# Altium project LED Dice v2.PrjPcb
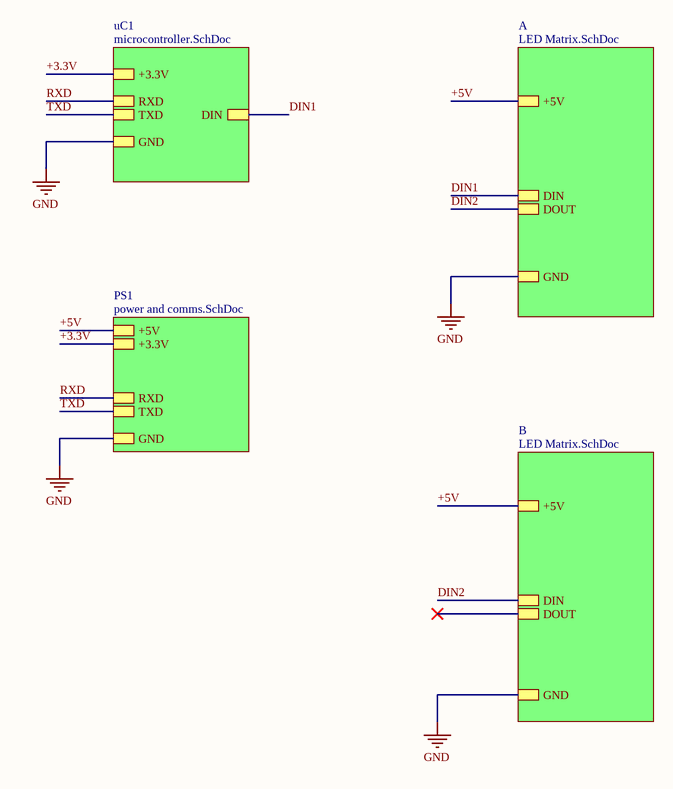
[diagram p0: LED Dice.SchDoc]
4 sheets, 52 parts. Net scope: hierarchical (ports join the sheet entries above them; power ports are global).
Board file: LED Dice.PcbDoc
Sheets:
  LED Dice.SchDoc
    uC1 = microcontroller.SchDoc
    PS1 = power and comms.SchDoc
    A = LED Matrix.SchDoc
    B = LED Matrix.SchDoc

## Sheet LED Dice.SchDoc
size A4; Date: 21 Jul 2025; CompanyName: Abdullah; Engineer: Abdullah; Revision: 2; SheetNumber: 1; SheetTotal: 4

### Sub-sheets
A = LED Matrix.SchDoc: GND, +5V, DIN, DOUT
B = LED Matrix.SchDoc: GND, +5V, DIN, DOUT
PS1 = power and comms.SchDoc: +5V, GND, +3.3V, RXD, TXD
uC1 = microcontroller.SchDoc: GND, +3.3V, RXD, TXD, DIN

### Nets
GND: sheet uC1/GND, sheet PS1/GND, sheet A/GND, sheet B/GND
+3.3V: sheet uC1/+3.3V, sheet PS1/+3.3V
+5V: sheet PS1/+5V, sheet A/+5V, sheet B/+5V
DIN1: sheet uC1/DIN, sheet A/DIN  [project net DIN]
DIN2: sheet A/DOUT, sheet B/DIN  [project net DIN]
RXD: sheet uC1/RXD, sheet PS1/RXD
TXD: sheet uC1/TXD, sheet PS1/TXD

### Notes on the sheet
- Project Title
- Engineer
- Company
- Revision
- Date
- Doc Name:
- Sheet
- of

## Sheet microcontroller.SchDoc
size A4; Date: 21 Jul 2025; CompanyName: Abdullah; Engineer: Abdullah; Revision: 2; SheetNumber: 3; SheetTotal: 4
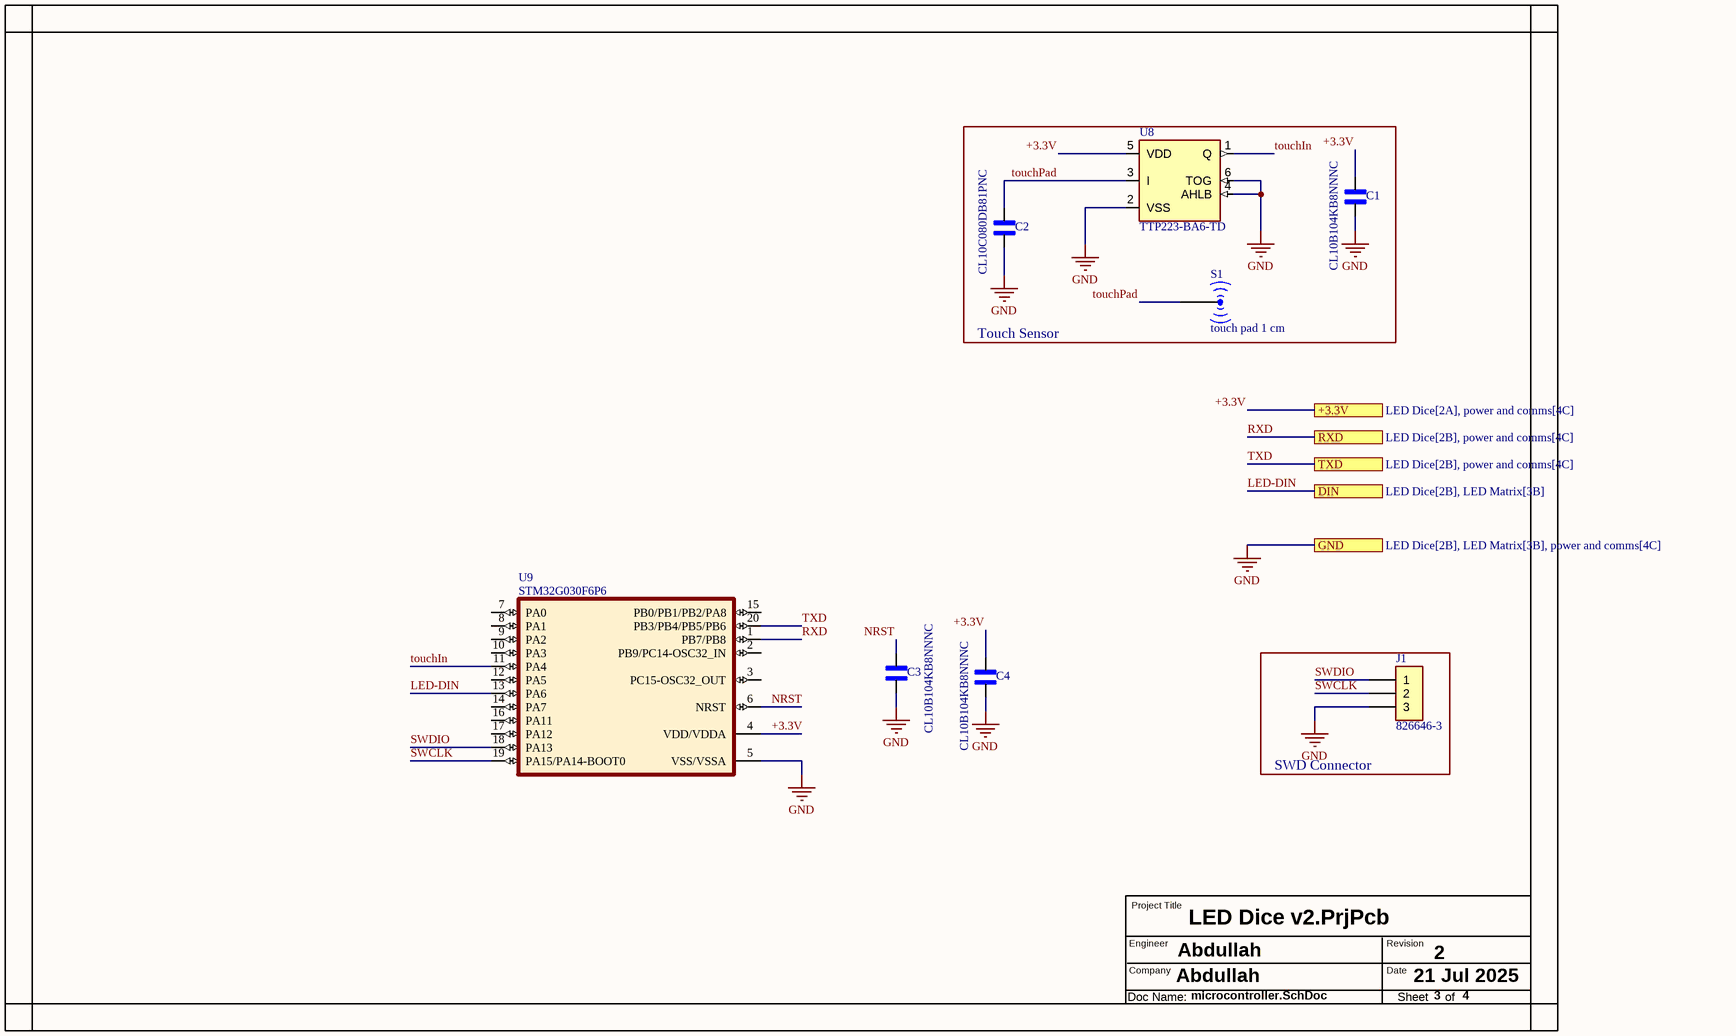
[diagram p1: microcontroller.SchDoc]

### Parts
C1  CL10B104KB8NNNC  [CAPC1608X90N]
C2  CL10C080DB81PNC  [CAPC1608X90N]
C3  CL10B104KB8NNNC  [CAPC1608X90N]
C4  CL10B104KB8NNNC  [CAPC1608X90N]
J1  826646-3  [TE_826646-3]
S1  touch pad 1 cm  [touch pad 1 cm]
U8  TTP223-BA6-TD  [SOT23-6]
U9  STM32G030F6P6  [*TSSOP20]

### Blocks framed on the sheet
Touch Sensor: C1 C2 S1 U8
SWD Connector: J1

### Ports
+3.3V (see LED Dice[2A], power and comms[4C]), DIN (see LED Dice[2B], LED Matrix[3B]), GND (see LED Dice[2B], LED Matrix[3B], power and comms[4C]), RXD (see LED Dice[2B], power and comms[4C]), TXD (see LED Dice[2B], power and comms[4C])

### Nets
GND: C1.1 C2.1 C3.1 C4.1 J1.3 U8.2(VSS) U8.4(AHLB) U8.6(TOG) U9.5(VSS/VSSA) ; port GND
+3.3V: C1.2 C4.2 U8.5(VDD) U9.4(VDD/VDDA) ; port +3.3V
LED-DIN: U9.13(PA6) ; port DIN  [project net DIN]
NRST: C3.2 U9.6(NRST)
RXD: U9.1(PB7/PB8) ; port RXD
SWCLK: J1.2 U9.19(PA15/PA14-BOOT0)
SWDIO: J1.1 U9.18(PA13)
touchIn: U8.1(Q) U9.11(PA4)
touchPad: C2.2 S1.1(in) U8.3(I)
TXD: U9.20(PB3/PB4/PB5/PB6) ; port TXD

Not connected (* = marked no-connect by the designer): U9 2(PB9/PC14-OSC32_IN) 3(PC15-OSC32_OUT) 7(PA0) 8(PA1) 9(PA2) 10(PA3) 12(PA5) 14(PA7) 15(PB0/PB1/PB2/PA8) 16(PA11) 17(PA12)

### Notes on the sheet
- Project Title
- Engineer
- Company
- Revision
- Date
- Doc Name:
- Sheet
- of

### Library data of the parts
C1 C3 C4 = CL10B104KB8NNNC: 0.1ÂµF Â±10% 50V Ceramic Capacitor X7R 0603 _1608 Metric_; MF: Samsung Electro-Mechanics; Price: None; MP: CL10B104KB8NNNC; SnapEDA_Link: https://www.snapeda.com/parts/CL10B104KB8NNNC/Samsung%20Electro-Mechanics/view-part/3598309/?ref=snap; Availability: Unavailable; Package: 0603 Samsung; Value: *
C2 = CL10C080DB81PNC: 50V 8pF C0G 0603 Multilayer Ceramic Capacitors MLCC - SMD/SMT ROHS; MP: GRM0335C1E8R0CA01D; Package: None; Price: None; Value: *; Availability: Unavailable
J1 = 826646-3: Connector Header Through Hole 3 position 0.100 (2.54mm); MF: TE Connectivity; SnapEDA_Link: https://www.snapeda.com/parts/826646-3/TE%20Connectivity%20AMP%20Connectors/view-part/2389612/?ref=snap; Mouser-Purchase-URL: https://snapeda.com/shop?store=Mouser&id=2389612; Availability: Good; DigiKey-Purchase-URL: https://snapeda.com/shop?store=DigiKey&id=2389612; MP: 826646-3; Package: None; Value: *; Price: None; EU_RoHS_Compliance: Compliant; Arrow_Europe-Purchase-URL: https://snapeda.com/shop?store=Arrow+Europe&id=2389612
S1 = touch pad 1 cm: Touch pad circular 1 cm
U8 = TTP223-BA6-TD: 1 key touchpad detector IC; MF: tontek; Value: *; SnapEDA_Link: https://www.snapeda.com/parts/TTP223-BA6/TONTEK/view-part/?ref=snap; Price: None; Availability: Not in stock; Package: None; MP: TTP223-BA6; Check_prices: https://www.snapeda.com/parts/TTP223-BA6/TONTEK/view-part/?ref=eda
U9 = STM32G030F6P6: ARMÂ® CortexÂ®-M0+ STM32G0 Microcontroller IC 32-Bit Single-Core 64MHz 32KB (32K x 8) FLASH 20-TSSOP; MF: STMicroelectronics; SnapEDA_Link: https://www.snapeda.com/parts/STM32G030F6P6/STMicroelectronics/view-part/?ref=snap; Package: TSSOP-20 STMicroelectronics; MP: STM32G030F6P6; Check_prices: https://www.snapeda.com/parts/STM32G030F6P6/STMicroelectronics/view-part/?ref=eda; Value: *

## Sheet power and comms.SchDoc
size A4; Date: 21 Jul 2025; CompanyName: Abdullah; Engineer: Abdullah; Revision: 2; SheetNumber: 4; SheetTotal: 4
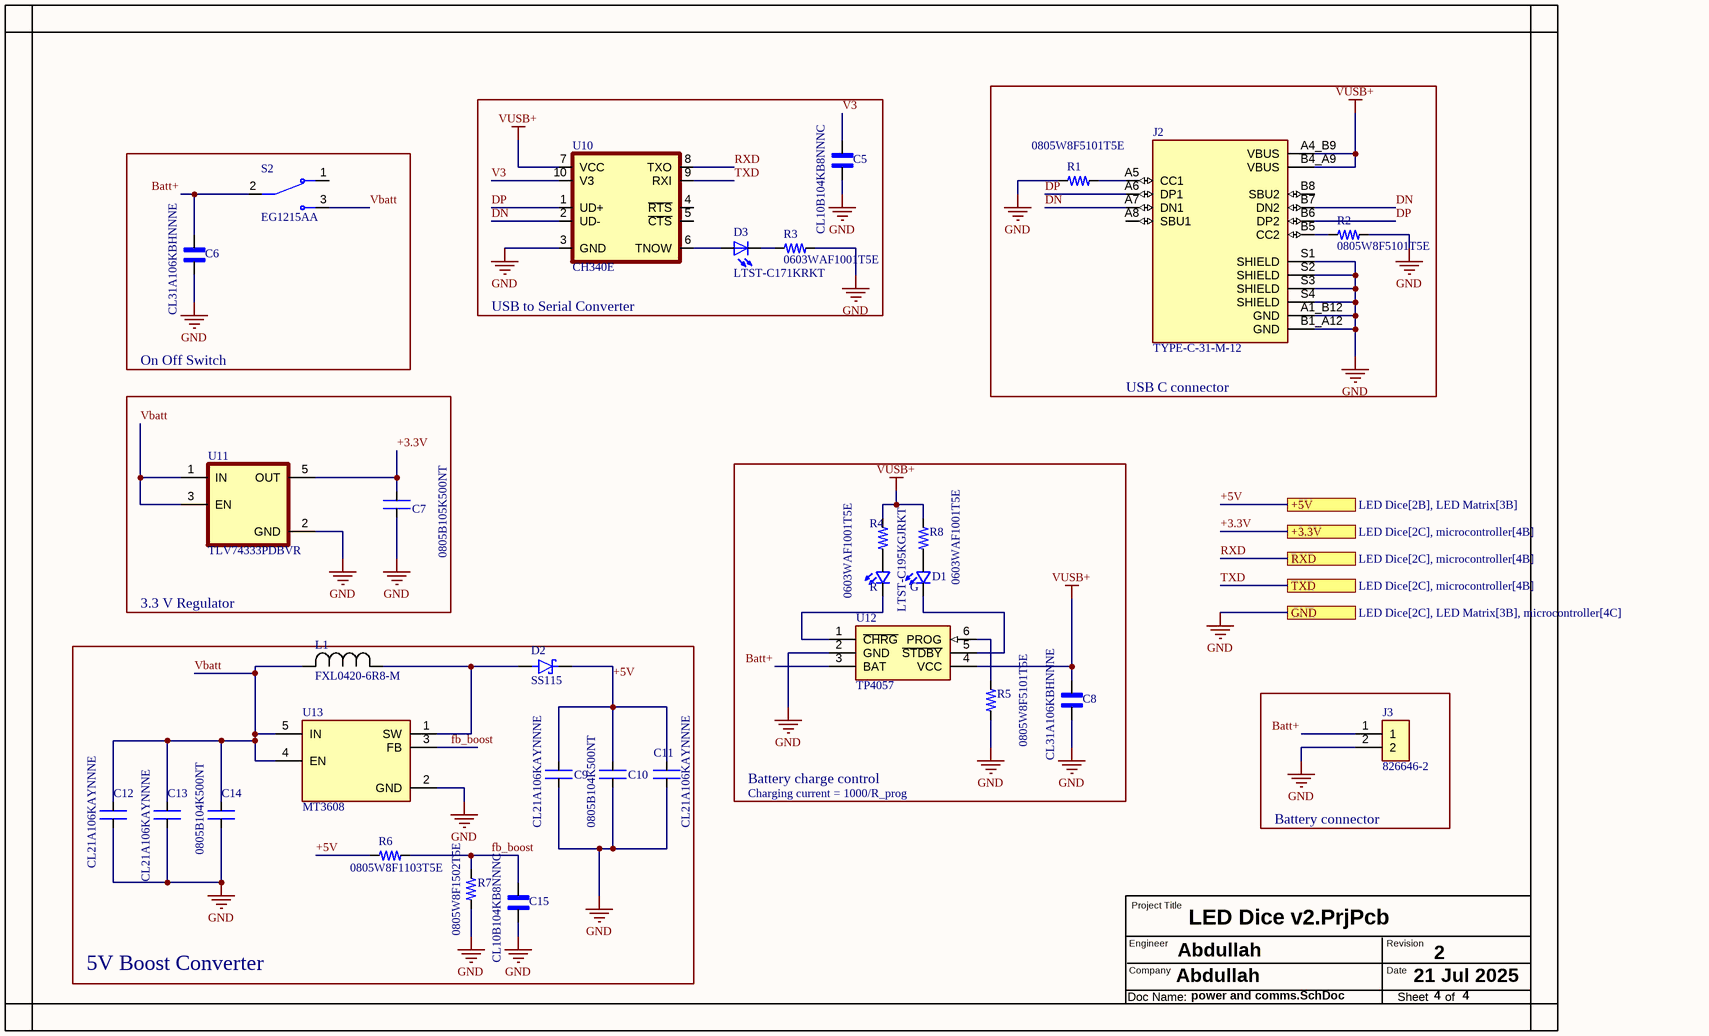
[diagram p2: power and comms.SchDoc]

### Parts
C5  CL10B104KB8NNNC  [CAPC1608X90N]
C6  CL31A106KBHNNNE  [WCAP-CSGP_885012208060]
C7  0805B105K500NT  [CAPC2012X135N]
C8  CL31A106KBHNNNE  [WCAP-CSGP_885012208060]
C9  CL21A106KAYNNNE  [CAPC2012X135N]
C10  CL21A106KAYNNNE  [CAPC2012X135N]
C11  0805B104K500NT  [CAPC2012X135N]
C12  CL21A106KAYNNNE  [CAPC2012X135N]
C13  CL21A106KAYNNNE  [CAPC2012X135N]
C14  0805B104K500NT  [CAPC2012X135N]
C15  CL10B104KB8NNNC  [CAPC1608X90N]
D1  LTST-C195KGJRKT  [LTST-BILED-15X16]
D2  SS115  [DIOM4325X250N]
D3  LTST-C171KRKT  [DIOC200X125X110]
J2  TYPE-C-31-M-12  [HRO_TYPE-C-31-M-12]
J3  826646-2  [TE_826646-2]
L1  FXL0420-6R8-M  [IND_FXL0420_CMT]
R1  0805W8F5101T5E  [RESC2012X65N]
R2  0805W8F5101T5E  [RESC2012X65N]
R3  0603WAF1001T5E  [RESC1508X60N]
R4  0603WAF1001T5E  [RESC1508X60N]
R5  0805W8F5101T5E  [RESC2012X65N]
R6  0805W8F1103T5E  [RESC2012X65N]
R7  0805W8F1502T5E  [RESC2012X65N]
R8  0603WAF1001T5E  [RESC1508X60N]
S2  EG1215AA  [SW_EG1215AA]
U10  CH340E  [MSOP10]
U11  TLV74333PDBVR  [SOT95P280X145-5N]
U12  TP4057  [SOT23-6]
U13  MT3608  [SOT95P280X145-6N]

### Blocks framed on the sheet
USB C connector: J2 R1 R2
USB to Serial Converter: C5 D3 R3 U10
On Off Switch: C6 S2
3.3 V Regulator: C7 U11
Battery charge control: C8 D1 R4 R5 R8 U12
5V Boost Converter: C9-C15 D2 L1 R6 R7 U13
Battery connector: J3

### Ports
+3.3V (see LED Dice[2C], microcontroller[4B]), +5V (see LED Dice[2B], LED Matrix[3B]), GND (see LED Dice[2C], LED Matrix[3B], microcontroller[4C]), RXD (see LED Dice[2C], microcontroller[4B]), TXD (see LED Dice[2C], microcontroller[4B])

### Nets
GND: C5.1 C6.1 C7.2(C) C8.1 C9.1(A) C10.1(A) C11.2(C) C12.1(A) C13.1(A) C14.2(C) C15.1 J2.A1_B12(GND) J2.B1_A12(GND) J2.S1(SHIELD) J2.S2(SHIELD) J2.S3(SHIELD) J2.S4(SHIELD) J3.2 R1.2 R2.1 R3.2 R5.1 R7.1 U10.3(GND) U11.2(GND) U12.2(GND) U13.2(GND) ; port GND
VUSB+: C8.2 J2.A4_B9(VBUS) J2.B4_A9(VBUS) R4.2 R8.2 U10.7(VCC) U12.4(VCC)
+3.3V: C7.1(A) U11.5(OUT) ; port +3.3V
+5V: C9.2(C) C10.2(C) C11.1(A) D2.C(K) R6.2 ; port +5V
Batt+: C6.2 J3.1 S2.2 U12.3(BAT)
DN: J2.A7(DN1) J2.B7(DN2) U10.2(UD-)
DP: J2.A6(DP1) J2.B6(DP2) U10.1(UD+)
fb_boost: C15.2 R6.1 R7.2 U13.3(FB)
RXD: U10.8(TXO) ; port RXD
TXD: U10.9(RXI) ; port TXD
V3: C5.2 U10.10(V3)
Vbatt: C12.2(C) C13.2(C) C14.1(A) L1.2 S2.3 U11.1(IN) U11.3(EN) U13.4(EN) U13.5(IN)
NetD1_P$1: D1.P$1(A1) R8.1
NetD1_P$2: D1.P$2(A2) R4.1
NetD1_P$3: D1.P$3(K1) U12.5(~{STDBY})
NetD1_P$4: D1.P$4(K2) U12.1(~{CHRG})
NetD2_A: D2.A L1.1 U13.1(SW)
NetD3_NEG: D3.NEG R3.1
NetD3_POS: D3.POS U10.6(TNOW)
NetJ2_A5: J2.A5(CC1) R1.1
NetJ2_B5: J2.B5(CC2) R2.2
NetR5_2: R5.2 U12.6(PROG)

Not connected (* = marked no-connect by the designer): J2 A8(SBU1) B8(SBU2); S2 1; U10 4(~{RTS}) 5(~{CTS})

### Notes on the sheet
- Charging current = 1000/R_prog
- Project Title
- Engineer
- Company
- Revision
- Date
- Doc Name:
- Sheet
- of
- (in symbol LTST-C195KGJRKT) R; G

### Library data of the parts
C5 C15 = CL10B104KB8NNNC: as C1 on sheet microcontroller; Price: None; MP: CL10B104KB8NNNC; SnapEDA_Link: https://www.snapeda.com/parts/CL10B104KB8NNNC/Samsung%20Electro-Mechanics/view-part/3598309/?ref=snap; Availability: Unavailable; Package: 0603 Samsung; Value: *
C6 C8 = CL31A106KBHNNNE: 50V 10uF X5R ±10% 1206 Multilayer Ceramic Capacitors MLCC - SMD/SMT ROHS; MP: 885012208060; Package: None; Price: None; Value: *; Availability: Unavailable
C7 = 0805B105K500NT: 50V 1uF X7R ±10% 0805 Multilayer Ceramic Capacitors MLCC - SMD/SMT ROHS
C9 C10 C12 C13 = CL21A106KAYNNNE: 25V 10uF X5R ±10% 0805 Multilayer Ceramic Capacitors MLCC - SMD/SMT ROHS; MP: CL31A106KPHNNNE; Package: None; Price: None; Value: *; Availability: Unavailable
C11 C14 = 0805B104K500NT: 50V 100nF X7R ±10% 0805 Multilayer Ceramic Capacitors MLCC - SMD/SMT ROHS; Supplier 1: Digikey; Supplier Part Number 1: 1763-1217-1-ND
D1 = LTST-C195KGJRKT: Green, Red 571nm Green, 631nm Red LED Indication - Discrete 2V Green, 2V Red 0606 (1616 Metric); MF: Lite-On Inc.; Package: None; Price: None; Check_prices: https://www.snapeda.com/parts/LTST-C195KGJRKT/Lite-On+Inc./view-part/?ref=eda; Value: *; SnapEDA_Link: https://www.snapeda.com/parts/LTST-C195KGJRKT/Lite-On+Inc./view-part/?ref=snap; MP: LTST-C195KGJRKT; Availability: In Stock; Purchase-URL: https://pricing.snapeda.com/search?q=LTST-C195KGJRKT&ref=eda
D2 = SS115: 1A, 150V, Schottky Rectifier; MF: Taiwan Semiconductor; Package: DO-214AC-2 Taiwan Semiconductor; Check_prices: https://www.snapeda.com/parts/SS115/Taiwan+Semiconductor/view-part/?ref=eda; Value: *; Price: None; Purchase-URL: https://pricing.snapeda.com/search/part/SS115/?ref=eda; MP: SS115; SnapEDA_Link: https://www.snapeda.com/parts/SS115/Taiwan+Semiconductor/view-part/?ref=snap; Availability: In Stock; Supplier 1: Digikey; Supplier Part Number 1: 1801-SS115TR-ND
D3 = LTST-C171KRKT: Red LED  0805 _2012 Indication 631nm - Discrete 2V 0805 _2012 Metric_; MF: Lite-On Inc.; MP: LTST-C171KRKT; Package: 0805 Lite-On; Price: None; Availability: Unavailable; SnapEDA_Link: https://www.snapeda.com/parts/LTST-C171KRKT/Lite-On%20Inc./view-part/357775/?ref=snap; Value: *
J2 = TYPE-C-31-M-12: USB Connectors 24 Receptacle 1 8.94*7.3mm RoHS; MF: HRO Electronics Co., Ltd.; Price: None; Value: *; SnapEDA_Link: https://www.snapeda.com/parts/TYPE-C-31-M-12/HRO+Electronics+Co.%252C+Ltd./view-part/?ref=snap; Package: Package; Availability: Not in stock; Check_prices: https://www.snapeda.com/parts/TYPE-C-31-M-12/HRO+Electronics+Co.%252C+Ltd./view-part/?ref=eda; MP: TYPE-C-31-M-12
J3 = 826646-2: Conn Unshrouded Header HDR 2 POS 2.54mm Solder ST Thru-Hole; Centerline_Pitch: 2.54 mm[.1 in]; Product_Type: Connector; MF: TE Connectivity; Number_of_Positions: 2; Availability: Good; Price: None; EU_RoHS_Compliance: Compliant; Value: *; DigiKey-Purchase-URL: https://snapeda.com/shop?store=DigiKey&id=470405; Mouser-Purchase-URL: https://snapeda.com/shop?store=Mouser&id=470405; SnapEDA_Link: https://www.snapeda.com/parts/826646-2/TE%20Connectivity%20AMP%20Connectors/view-part/470405/?ref=snap; Package: None; MP: 826646-2
L1 = FXL0420-6R8-M: Description; Manufacturer_Name: Cjiang; Copyright: Copyright (C) 2025 Ultra Librarian. All rights reserved.; Manufacturer_Part_Number: FXL0420-6R8-M
R1 R2 R5 = 0805W8F5101T5E: 5.1kΩ 0805  125mW Thick Film Resistors 150V ±100ppm/℃ ±1% Chip Resistor - Surface Mount ROHS
R3 R4 R8 = 0603WAF1001T5E: 1kΩ 0603 100mW Thick Film Resistors 75V ±100ppm/℃ ±1%  Chip Resistor - Surface Mount ROHS
R6 = 0805W8F1103T5E: 110kΩ 0805  125mW Thick Film Resistors 150V ±100ppm/℃ ±1% Chip Resistor - Surface Mount ROHS; Supplier 1: Mouser; Supplier Part Number 1: 303-0805W8F1001T5E
R7 = 0805W8F1502T5E: 15kΩ 0805  125mW Thick Film Resistors 150V ±100ppm/℃ ±1% Chip Resistor - Surface Mount ROHS; Supplier 1: Mouser; Supplier Part Number 1: 303-0805W8F1001T5E
S2 = EG1215AA: Slide Switch SPDT Surface Mount, Right Angle; MF: E-Switch; Check_prices: https://www.snapeda.com/parts/EG1215AA/E-Switch/view-part/?ref=eda; SnapEDA_Link: https://www.snapeda.com/parts/EG1215AA/E-Switch/view-part/?ref=snap; Value: *; Purchase-URL: https://pricing.snapeda.com/search/part/EG1215AA/?ref=eda; Package: None; MP: EG1215AA
U10 = CH340E: USB to serial chip CH340; MF: WCH; SnapEDA_Link: https://www.snapeda.com/parts/CH340E/WCH/view-part/?ref=snap; Package: Package; Value: *; MP: CH340E; Check_prices: https://www.snapeda.com/parts/CH340E/WCH/view-part/?ref=eda
U11 = TLV74333PDBVR: 300mA Fixed 3.3V Positive electrode 5.5V SOT-23-5 Voltage Regulators - Linear, Low Drop Out (LDO) Regulators ROHS; MF: Texas Instruments; MP: TLV74330PDBVR; Package: SOT-23-5 Texas Instruments; Check_prices: https://www.snapeda.com/parts/TLV74330PDBVR/Texas%20Instruments/view-part/2878367/?ref=eda; Price: None; SnapEDA_Link: https://www.snapeda.com/parts/TLV74330PDBVR/Texas%20Instruments/view-part/2878367/?ref=snap; Value: *; Purchase-URL: https://pricing.snapeda.com/search/part/TLV74330PDBVR/?ref=eda; Availability: Warning
U12 = TP4057: 500mA linear li-ion battery charger TP4057 actual charge current to 500ma,; MF: toppower; SnapEDA_Link: https://www.snapeda.com/parts/TP4057/Top+Power/view-part/?ref=snap; Package: None; MP: TP4057; Check_prices: https://www.snapeda.com/parts/TP4057/Top+Power/view-part/?ref=eda; Price: None; Value: *; Availability: Not in stock
U13 = MT3608: High Efficiency 1.2MHz2A Step Up Converter; MF: Aerosemi Technology Co., Ltd; Price: None; Availability: Not in stock; Package: Package; MP: MT3608; Value: *; SnapEDA_Link: https://www.snapeda.com/parts/MT3608/Aerosemi+Technology+Co.%252C+Ltd/view-part/?ref=snap; Check_prices: https://www.snapeda.com/parts/MT3608/Aerosemi+Technology+Co.%252C+Ltd/view-part/?ref=eda

## Sheet LED Matrix.SchDoc
size A4; Date: 29 Jul 2025; CompanyName: Abdullah; Engineer: Abdullah; Revision: 2; SheetNumber: 2; SheetTotal: 4
Used 2 times, as channels A, B. Parts and nets are listed once, with the designators drawn on the sheet.
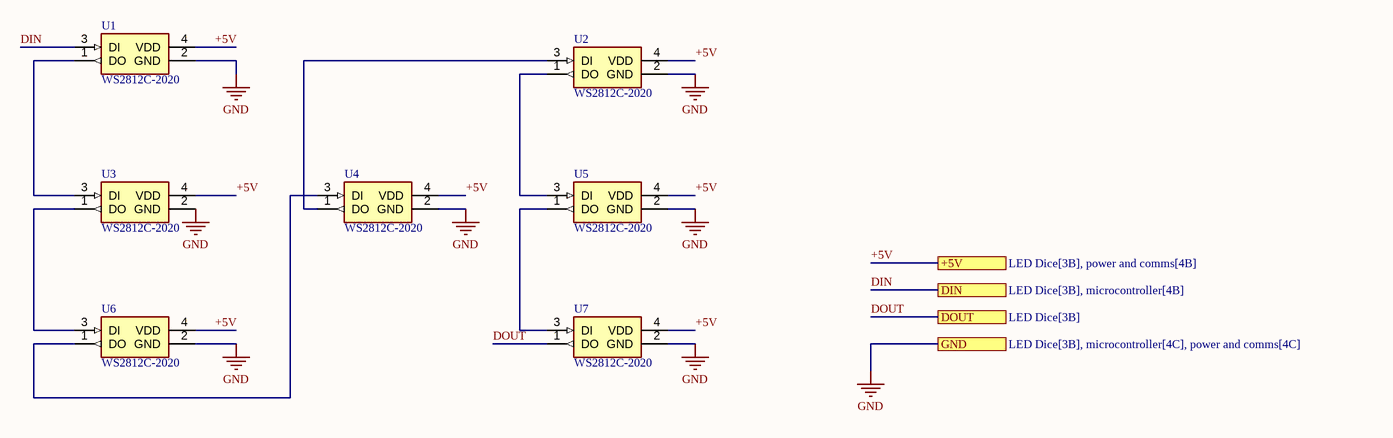
[diagram p3: LED Matrix.SchDoc]

### Parts
U1  WS2812C-2020  [LED_WS2812C-2020]
U2  WS2812C-2020  [LED_WS2812C-2020]
U3  WS2812C-2020  [LED_WS2812C-2020]
U4  WS2812C-2020  [LED_WS2812C-2020]
U5  WS2812C-2020  [LED_WS2812C-2020]
U6  WS2812C-2020  [LED_WS2812C-2020]
U7  WS2812C-2020  [LED_WS2812C-2020]

### Ports
+5V (see LED Dice[3B], power and comms[4B]), DIN (see LED Dice[3B], microcontroller[4B]), DOUT (see LED Dice[3B]), GND (see LED Dice[3B], microcontroller[4C], power and comms[4C])

### Nets
GND: U1.2(GND) U2.2(GND) U3.2(GND) U4.2(GND) U5.2(GND) U6.2(GND) U7.2(GND) ; port GND
+5V: U1.4(VDD) U2.4(VDD) U3.4(VDD) U4.4(VDD) U5.4(VDD) U6.4(VDD) U7.4(VDD) ; port +5V
DIN: U1.3(DI) ; port DIN
DOUT: U7.1(DO) ; port DOUT
NetU1_1: U1.1(DO) U3.3(DI)
NetU2_1: U2.1(DO) U5.3(DI)
NetU2_3: U2.3(DI) U4.1(DO)
NetU3_1: U3.1(DO) U6.3(DI)
NetU4_3: U4.3(DI) U6.1(DO)
NetU5_1: U5.1(DO) U7.3(DI)

### Channels
A: designators end in A; ports +5V=+5V DIN=DIN DOUT=DIN GND=GND
B: designators end in B; ports +5V=+5V DIN=DIN DOUT=DOUT_B GND=GND

### Notes on the sheet
- Project Title
- Engineer
- Company
- Revision
- Date
- Doc Name:
- Sheet
- of

### Library data of the parts
U1-U7 = WS2812C-2020: Intelligent control LED integrated light source; MF: Worldsemi; SnapEDA_Link: https://www.snapeda.com/parts/WS2812C-2020/Worldsemi/view-part/?ref=snap; Package: Package; Value: *; MP: WS2812C-2020; Check_prices: https://www.snapeda.com/parts/WS2812C-2020/Worldsemi/view-part/?ref=eda

## Nets that join several sheets
GND: microcontroller (9 pins), power and comms (27 pins), A (7 pins), B (7 pins)
+3.3V: microcontroller (C1.2 C4.2 U8.5 U9.4), power and comms (C7.1 U11.5)
+5V: power and comms (5 pins), A (7 pins), B (7 pins)
DIN: microcontroller (U9.13), A (U1A.3)
DIN: A (U7A.1), B (U1B.3)
RXD: microcontroller (U9.1), power and comms (U10.8)
TXD: microcontroller (U9.20), power and comms (U10.9)